# Altium schematic sheet quick-907.SchDoc
size A4; SheetNumber: 2; SheetTotal: 2
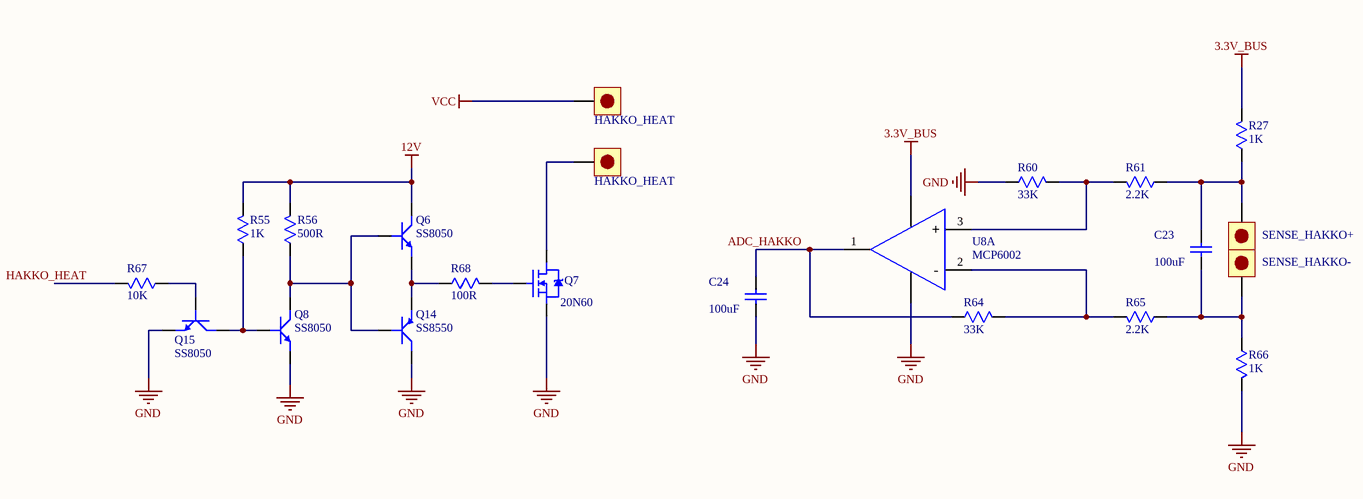
[diagram p0: quick-907.SchDoc]

## Parts
C23  100uF  [C0805]
C24  100uF  [C0805]
PAD8  SENSE_HAKKO-  [THROUGH_HOLE_MEDIUM]
PAD9  SENSE_HAKKO+  [THROUGH_HOLE_MEDIUM]
PAD15  HAKKO_HEAT  [THROUGH_HOLE_MEDIUM]
PAD16  HAKKO_HEAT  [THROUGH_HOLE_MEDIUM]
Q6  SS8050  [SOT-23]
Q7  20N60  [TO-252-2]
Q8  SS8050  [SOT-23]
Q14  SS8550  [SOT-23]
Q15  SS8050  [SOT-23]
R27  1K  [R0805]
R55  1K  [R0805]
R56  500R  [R0805]
R60  33K  [R0805]
R61  2.2K  [R0805]
R64  33K  [R0805]
R65  2.2K  [R0805]
R66  1K  [R0805]
R67  10K  [R0805]
R68  100R  [R0805]
U8  MCP6002  [DIP-8]  (part A of 2)

## Nets
3.3V_BUS: R27.2 U8.8
12V: Q6.3(C) R55.1 R56.1
GND: C24.2 Q7.3(S) Q8.2(E) Q14.3(C) Q15.2(E) R60.1 R66.2 U8.4
VCC: PAD15.1
ADC_HAKKO: C24.1 R64.1 U8.1
HAKKO_HEAT: R67.1
NetC23_1: C23.1 PAD9.1 R27.1 R61.1
NetC23_2: C23.2 PAD8.1 R65.1 R66.1
NetPAD16_1: PAD16.1 Q7.2(D)
NetQ6_1: Q6.1(B) Q8.3(C) Q14.1(B) R56.2
NetQ6_2: Q6.2(E) Q14.2(E) R68.2
NetQ7_1: Q7.1(G) R68.1
NetQ8_1: Q8.1(B) Q15.3(C) R55.2
NetQ15_1: Q15.1(B) R67.2
NetR60_2: R60.2 R61.2 U8.3(+)
NetR64_2: R64.2 R65.2 U8.2(-)

## Library data of the parts
C23 C24 = Capacitor_non-polar
PAD8 PAD9 PAD15 PAD16 = Pad_Through_Hole
Q6 Q8 Q15 = Transistor-NPN
Q7 = MOSFET_N-Chanel
Q14 = Transistor-PNP
R27 R55 R56 R60 R61 R64-R68 = Resistor
U8 = Op-Amply/Comparator